# Altium project ESP32-PCB-Antenna-USB-Dongle-Motion-Sensor.PrjPcb
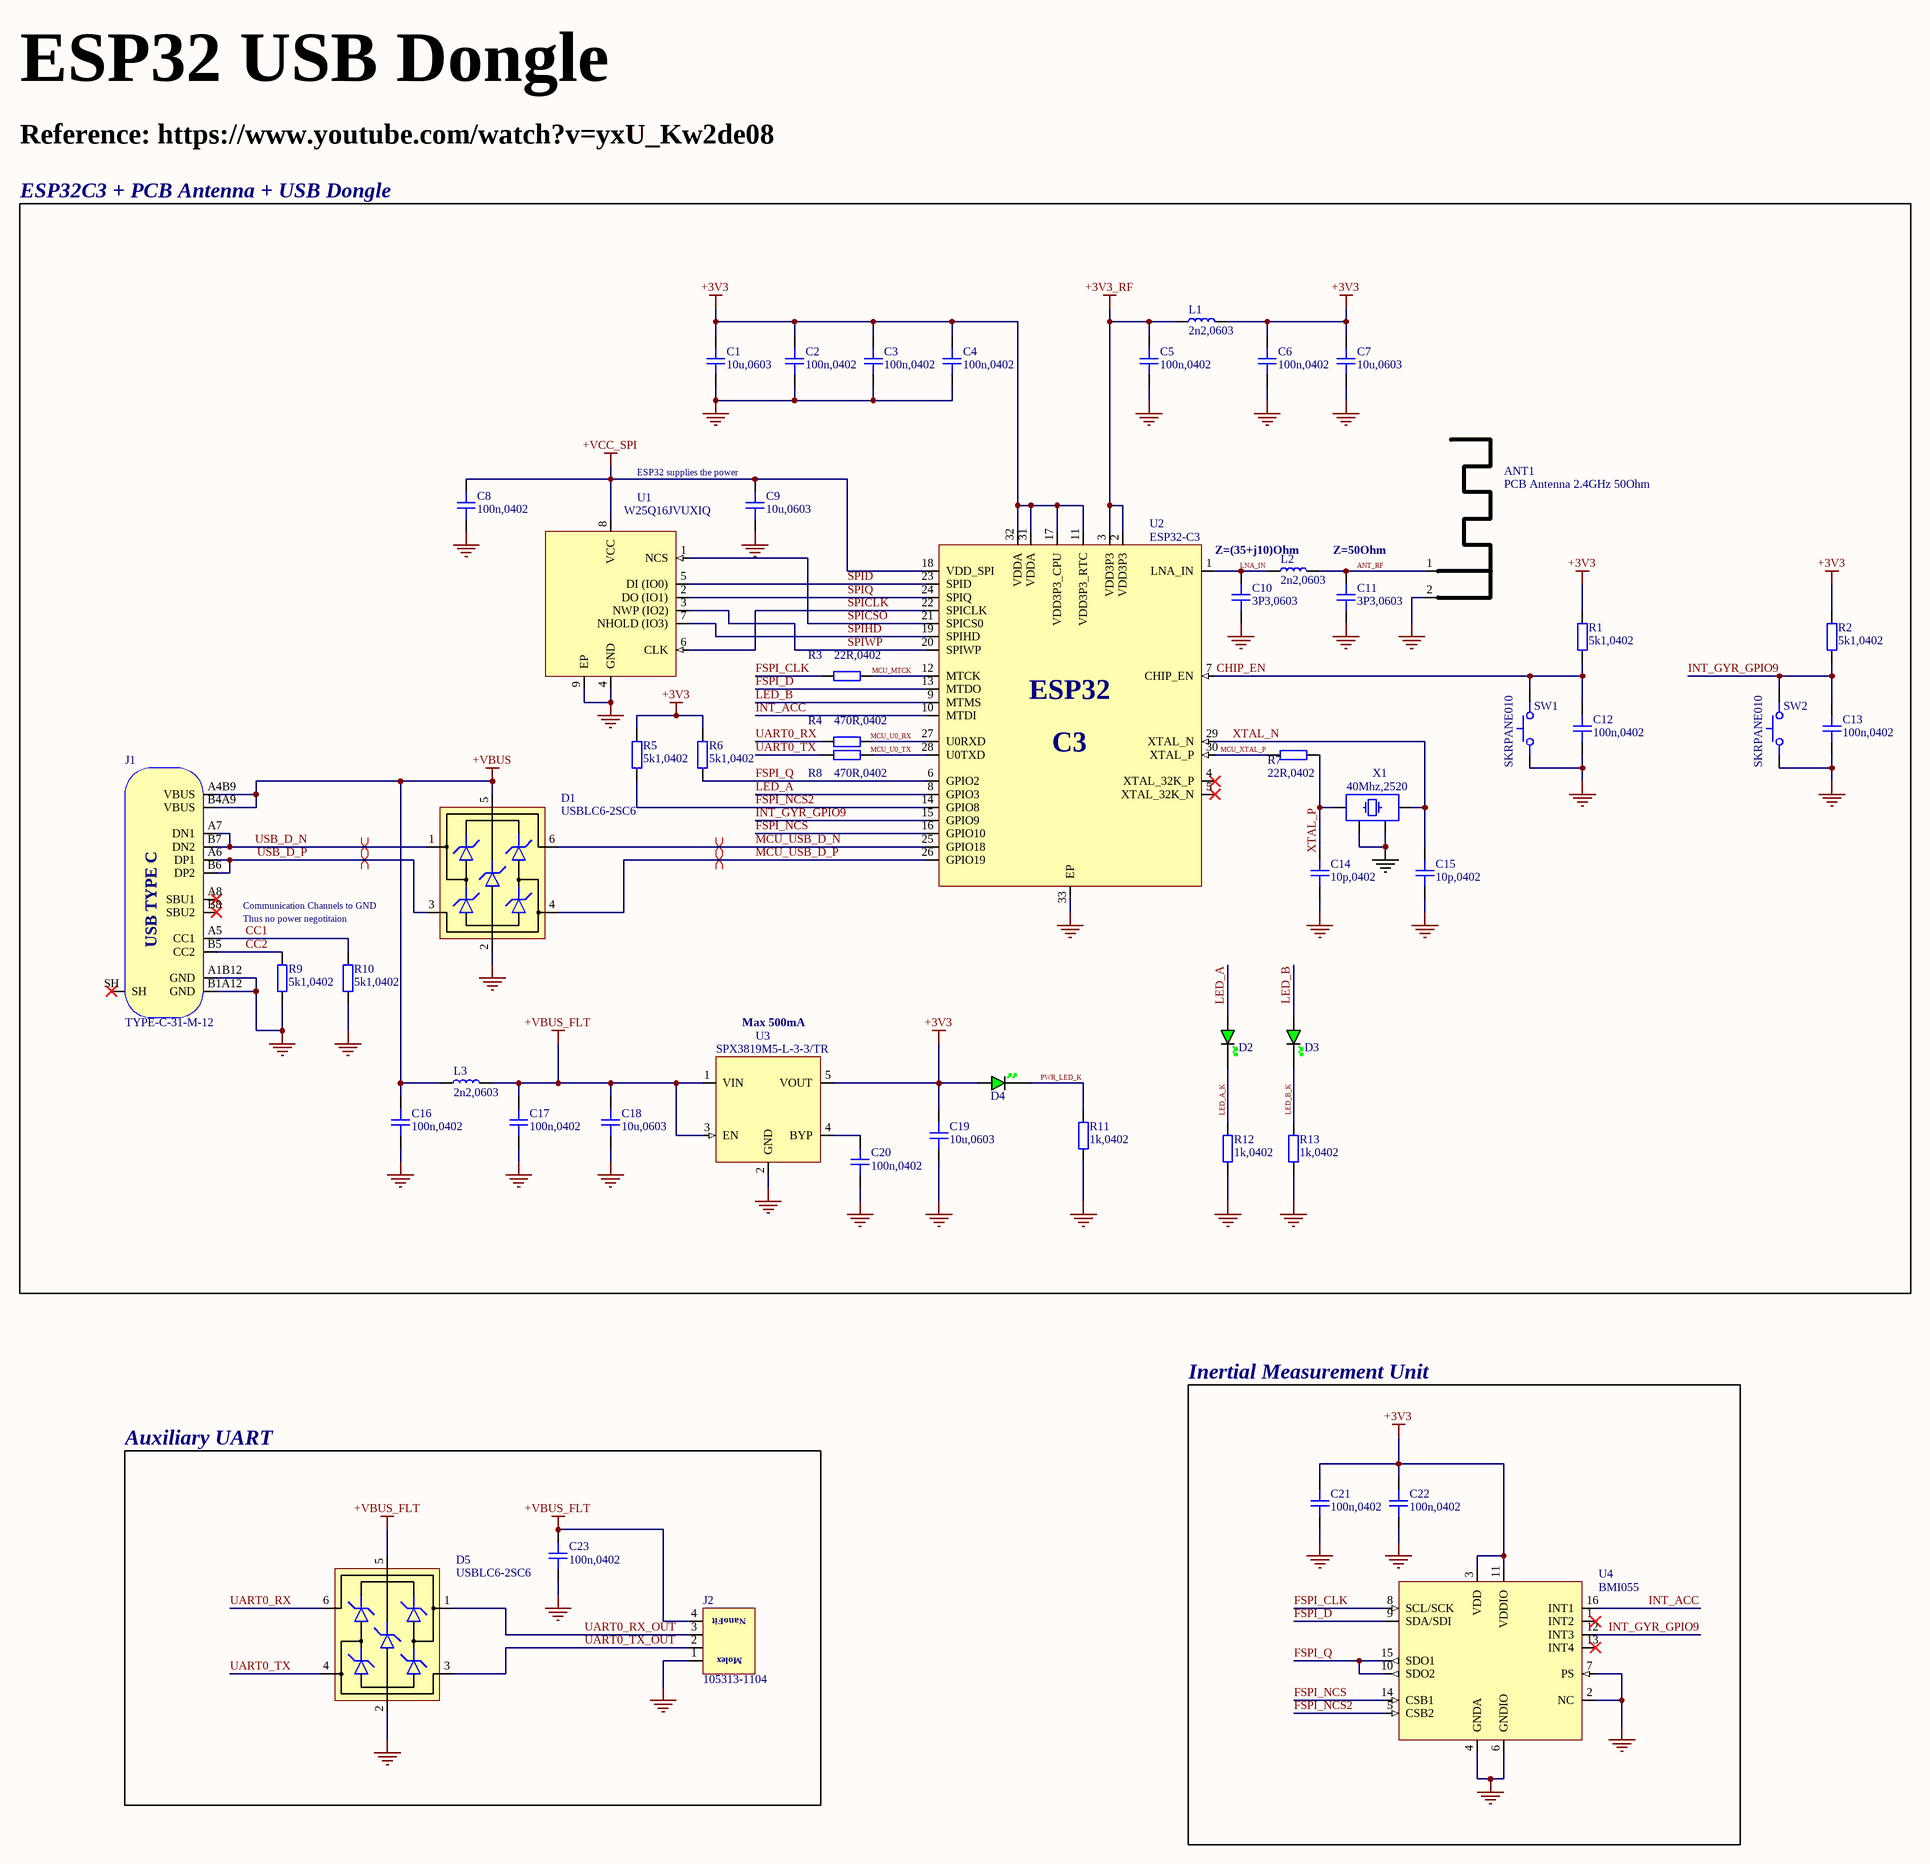
[diagram p0: ESP32-PCB-Antenna-USB-Dongle-Motion-Sensor.SchDoc]
1 sheet, 54 parts. Net scope: global (net labels, ports and power ports of the same name join across sheets).
Board file: ESP32-PCB-Antenna-USB-Dongle-Motion-Sensor.PcbDoc

## Sheet ESP32-PCB-Antenna-USB-Dongle-Motion-Sensor.SchDoc
size A2; SheetNumber: 1; SheetTotal: 1

### Parts
ANT1  PCB Antenna 2.4GHz 50Ohm  [ANT_IFA_USB_2_4GHZ_50R]  (no BOM)
C1  10u,0603  [CAP_0603]
C2  100n,0402  [CAP_0402]
C3  100n,0402  [CAP_0402]
C4  100n,0402  [CAP_0402]
C5  100n,0402  [CAP_0402]
C6  100n,0402  [CAP_0402]
C7  10u,0603  [CAP_0603]
C8  100n,0402  [CAP_0402]
C9  10u,0603  [CAP_0603]
C10  3P3,0603  [CAP_0603]
C11  3P3,0603  [CAP_0603]
C12  100n,0402  [CAP_0402]
C13  100n,0402  [CAP_0402]
C14  10p,0402  [CAP_0402]
C15  10p,0402  [CAP_0402]
C16  100n,0402  [CAP_0402]
C17  100n,0402  [CAP_0402]
C18  10u,0603  [CAP_0603]
C19  10u,0603  [CAP_0603]
C20  100n,0402  [CAP_0402]
C21  100n,0402  [CAP_0402]
C22  100n,0402  [CAP_0402]
C23  100n,0402  [CAP_0402]
D1  USBLC6-2SC6  [SOT-23-6]
D2  GREEN  [LED_0402_GREEN]  (value not drawn)
D3  GREEN  [LED_0402_GREEN]  (value not drawn)
D4  GREEN  [LED_0402_GREEN]  (value not drawn)
D5  USBLC6-2SC6  [SOT-23-6]
J1  TYPE-C-31-M-12  [TYPE-C-31-M-12]
J2  105313-1104  [105313-1104]
L1  2n2,0603  [IND_0603]
L2  2n2,0603  [IND_0603]
L3  2n2,0603  [IND_0603]
R1  5k1,0402  [RES_0402]
R2  5k1,0402  [RES_0402]
R3  22R,0402  [RES_0402]
R4  470R,0402  [RES_0402]
R5  5k1,0402  [RES_0402]
R6  5k1,0402  [RES_0402]
R7  22R,0402  [RES_0402]
R8  470R,0402  [RES_0402]
R9  5k1,0402  [RES_0402]
R10  5k1,0402  [RES_0402]
R11  1k,0402  [RES_0402]
R12  1k,0402  [RES_0402]
R13  1k,0402  [RES_0402]
SW1  SKRPANE010  [SKRPANE010]
SW2  SKRPANE010  [SKRPANE010]
U1  W25Q16JVUXIQ  [USON-8-2X3MM]
U2  ESP32-C3  [QFN32-5x5]
U3  SPX3819M5-L-3-3/TR  [SOT-23-5]
U4  BMI055  [BMI088]
X1  40Mhz,2520  [XTAL_2520]

### Blocks framed on the sheet
ESP32C3 + PCB Antenna + USB Dongle: ANT1 C1-C20 D1-D4 J1 L1-L3 R1-R13 SW1 SW2 U1-U3 X1
Inertial Measurement Unit: C21 C22 U4
Auxiliary UART: C23 D5 J2

### Nets
+3V3: C1.2 C2.2 C3.2 C4.2 C6.2 C7.2 C19.2 C21.2 C22.2 D4.A L1.2 R1.2 R2.2 R5.2 R6.2 U2.11(VDD3P3_RTC) U2.17(VDD3P3_CPU) U2.31(VDDA) U2.32(VDDA) U3.5(VOUT) U4.3(VDD) U4.11(VDDIO)
+3V3_RF: C5.2 L1.1 U2.2(VDD3P3) U2.3(VDD3P3)
+VBUS: C16.2 D1.5(VBUS) J1.A4B9(VBUS) J1.B4A9(VBUS) L3.1
+VBUS_FLT: C17.2 C18.2 C23.2 D5.5(VBUS) J2.4 L3.2 U3.1(VIN) U3.3(EN)
+VCC_SPI: C8.2 C9.2 U1.8(VCC) U2.18(VDD_SPI)
GND: ANT1.2(GND) C1.1 C2.1 C3.1 C4.1 C5.1 C6.1 C7.1 C8.1 C9.1 C10.2 C11.2 C12.1 C13.1 C14.1 C15.1 C16.1 C17.1 C18.1 C19.1 C20.1 C21.1 C22.1 C23.1 D1.2(GND) D5.2(GND) J1.A1B12(GND) J1.B1A12(GND) J2.1 R9.1 R10.1 R11.1 R12.1 R13.1 SW1.12 SW2.12 U1.4(GND) U1.9(EP) U2.33(EP) U3.2(GND) U4.2(NC) U4.4(GNDA) U4.6(GNDIO) U4.7(PS) X1.2 X1.4
ANT_RF: ANT1.1(RF) C11.1 L2.2
CC1: J1.A5(CC1) R10.2
CC2: J1.B5(CC2) R9.2
CHIP_EN: C12.2 R1.1 SW1.34 U2.7(CHIP_EN)
FSPI_CLK: R3.1 U4.8(SCL/SCK)
FSPI_D: U2.13(MTDO) U4.9(SDA/SDI)
FSPI_NCS: U2.16(GPIO10) U4.14(CSB1)
FSPI_NCS2: R5.1 U2.14(GPIO8) U4.5(CSB2)
FSPI_Q: R6.1 U2.6(GPIO2) U4.10(SDO2) U4.15(SDO1)
INT_ACC: U2.10(MTDI) U4.16(INT1)
INT_GYR_GPIO9: C13.2 R2.1 SW2.34 U2.15(GPIO9) U4.12(INT3)
LED_A: D2.A U2.8(GPIO3)
LED_A_K: D2.K R12.2
LED_B: D3.A U2.9(MTMS)
LED_B_K: D3.K R13.2
LNA_IN: C10.1 L2.1 U2.1(LNA_IN)
MCU_MTCK: R3.2 U2.12(MTCK)
MCU_U0_RX: R4.2 U2.27(U0RXD)
MCU_U0_TX: R8.2 U2.28(U0TXD)
MCU_USB_D_N: D1.6(IO1) U2.25(GPIO18)
MCU_USB_D_P: D1.4(IO2) U2.26(GPIO19)
MCU_XTAL_P: R7.1 U2.30(XTAL_P)
PWR_LED_K: D4.K R11.2
SPICLK: U1.6(CLK) U2.22(SPICLK)
SPICSO: U1.1(NCS) U2.21(SPICS0)
SPID: U1.5(DI_(IO0)) U2.23(SPID)
SPIHD: U1.7(NHOLD_(IO3)) U2.19(SPIHD)
SPIQ: U1.2(DO_(IO1)) U2.24(SPIQ)
SPIWP: U1.3(NWP_(IO2)) U2.20(SPIWP)
UART0_RX: D5.6(IO1) R4.1
UART0_RX_OUT: D5.1(IO1) J2.3
UART0_TX: D5.4(IO2) R8.1
UART0_TX_OUT: D5.3(IO2) J2.2
USB_D_N: D1.1(IO1) J1.A7(DN1) J1.B7(DN2)
USB_D_P: D1.3(IO2) J1.A6(DP1) J1.B6(DP2)
XTAL_N: C15.2 U2.29(XTAL_N) X1.3
XTAL_P: C14.2 R7.2 X1.1
NetC20_2: C20.2 U3.4(BYP)

Not connected (* = marked no-connect by the designer): J1 A8(SBU1)* B8(SBU2)* SH*; U2 4(XTAL_32K_P)* 5(XTAL_32K_N)*; U4 1(INT2)* 13(INT4)*

### Layout directives
differential pair: MCU_USB_D_N, MCU_USB_D_P, USB_D_N, USB_D_P

### Notes on the sheet
- ESP32 USB Dongle
- Reference: https://www.youtube.com/watch?v=yxU_Kw2de08
- (near C9) ESP32 supplies the power
- Z=(35+j10)Ohm
- Z=50Ohm
- Communication Channels to GND
- Thus no power negotitaion
- Max 500mA
- (in symbol 105313-1104) NanoFit
- (in symbol ESP32-C3) ESP32; C3
- (in symbol TYPE-C-31-M-12) USB TYPE C

### Library data of the parts
ANT1 = ANT_IFA_USB_2_4GHZ_50R: Inverted F 2.4GHz ISM PCB Antenna 50 Ohm; ComponentLink1Description: Datasheet; ComponentLink1URL: https://www.ti.com/lit/an/swra117d/swra117d.pdf
C1 C7 C9-C11 C18 C19 = CAP_0603_25V: Capacitor SMD 0603 25V
C2-C6 C8 C12-C17 C20-C23 = CAP_0402_16V: Capacitor SMD 0402 16V
D1 D5 = USBLC6-2SC6: Low-Capacitance ESD Protection USB; Manufacturer: STMicroelectronics; Manufacturer Part Number: USBLC6-2SC6; Distributor Link: https://www.mouser.de/ProductDetail/STMicroelectronics/USBLC6-2SC6?qs=po45yt2pPpu%2FhNIlwQdTlg%3D%3D
D2-D4 = LED_0402_GREEN: LED 0402 GREEN SMD
J1 = TYPE-C-31-M-12: USB Type C Connector Horizontal SMT; Manufacturer: Koren Hroparts; Manufacturer Part Number: TYPE-C-31-M-12
J2 = 105313-1104: Nano-Fit Right-Angle Header, Through Hole, 2.50mm Pitch, Single Row, 2 Circuits, Tin (Sn) Plating, Black, Glow-Wire Capable, Tray; Manufacturer: Molex; Manufacturer Part Number: 105313-1104
L1-L3 = IND_0603: Inductor SMD 0603
R1-R13 = RES_0402: Resistor SMD 0402; Manufacturer: *; Manufacturer Part Number: *; Distributor Link: *
SW1 SW2 = SKRPANE010: Tactile Switch SMD SPST; Manufacturer: Alps Alpine; Manufacturer Part Number: SKRPANE010
U1 = W25Q16JVUXIQ: 16M-BIT SERIAL FLASH MEMORY WITH DUAL/QUAD SPI USON-8; Manufacturer: Winbond; Manufacturer Part Number: W25Q16JVUXIQ; LCSC: C2843335
U2 = ESP32-C3: Ultra­Low­Power SoC with RISC­V Single­Core CPU Supporting IEEE 802.11b/g/n (2.4 GHz Wi­Fi) and Bluetooth® 5 (LE); Manufacturer: Espressif; Manufacturer Part Number: ESP32-C3; LCSC: C2838500
U3 = SPX3819M5-L-3-3/TR: 500mA +3.3V Low-Noise LDO Voltage Regulator; Manufacturer: MaxLinear; Manufacturer Part Number: SPX3819M5-L-3-3/TR
U4 = BMI055: Inertial Measurement Unit IMU 6-Axis LGA; Manufacturer: Bosch; Manufacturer Part Number: BMI055; LCSC: C189620
X1 = XTAL_2520: Crystal SMD 2520; Distributor Link: *